# EAGLE design MotorControllerChipTest (EAGLE 9.1.0)
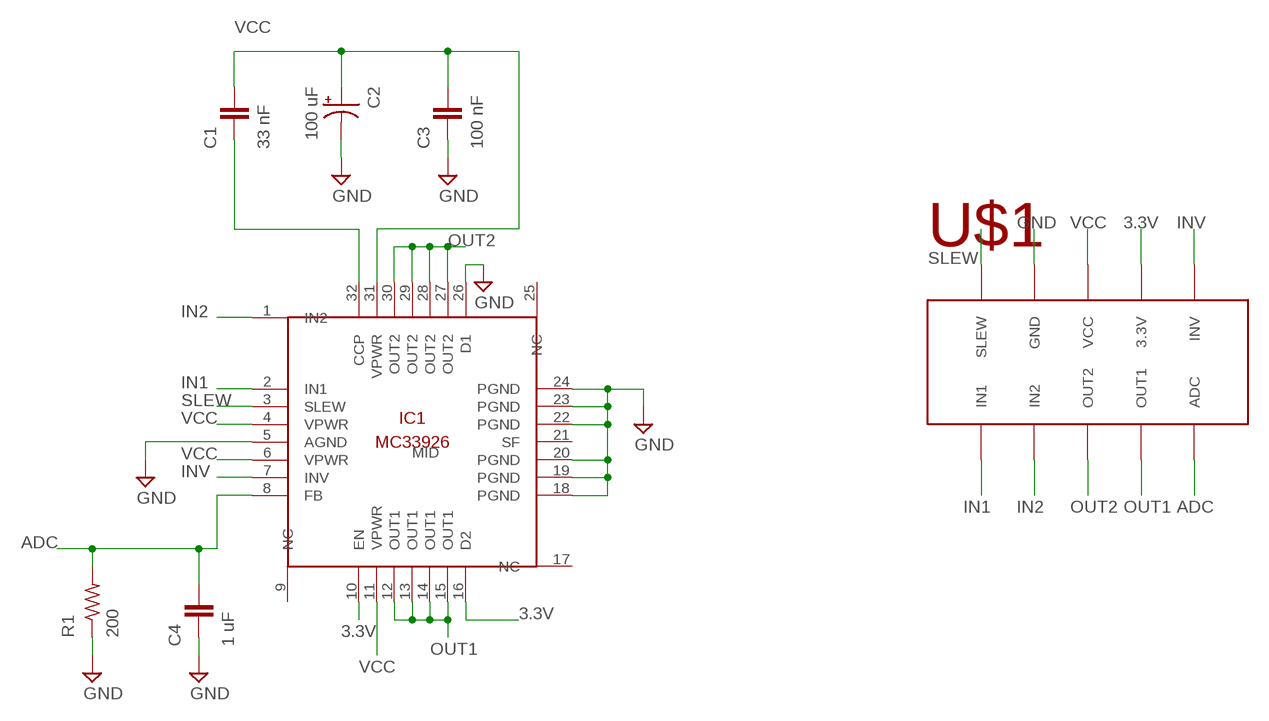
[diagram p0: schematic, sheet 1]

## Parts
C1  33 nF  CAP0603-CAP  [0603-CAP]
C2  100 uF  CAP_POLRADIAL  [.248"CAP_THRU]
C3  100 nF  CAP0603-CAP  [0603-CAP]
C4  1 uF  CAP0603-CAP  [0603-CAP]
IC1  MC33926  [PQFN-32]
R1  200  R-US_R0603  [R0603]
U$1  2X5PIN  [2X5PIN]

## Nets
3.3V: IC1.10(EN) IC1.16(D2) U$1.3.3V
ADC: C4.2 IC1.8(FB) R1.2 U$1.ADC
GND: C2.MINUS(-) C3.1 C4.1 IC1.5(AGND) IC1.18(PGND) IC1.19(PGND) IC1.20(PGND) IC1.22(PGND) IC1.23(PGND) IC1.24(PGND) IC1.26(D1) R1.1 U$1.GND
IN1: IC1.2(IN1) U$1.IN1
IN2: IC1.1(IN2) U$1.IN2
INV: IC1.7(INV) U$1.INV
N$2: C1.1 IC1.32(CCP)
OUT1: IC1.12(OUT1) IC1.13(OUT1) IC1.14(OUT1) IC1.15(OUT1) U$1.OUT1
OUT2: IC1.27(OUT2) IC1.28(OUT2) IC1.29(OUT2) IC1.30(OUT2) U$1.OUT2
SLEW: IC1.3(SLEW) U$1.SLEW
VCC: C1.2 C2.PLUS(+) C3.2 IC1.4(VPWR) IC1.6(VPWR) IC1.11(VPWR) IC1.31(VPWR) U$1.VCC
Unconnected: IC1.9(NC) IC1.17(NC) IC1.21(SF) IC1.25(NC) IC1.MID(AGND)

## Library data of the parts
C1 C3 C4 = pie:CAP: Capacitor Standard 0603 ceramic capacitor, and 0.1" leaded capacitor.; PIE-INT-REF-NUM: CAPACITOR-GENERIC
C2 = pie:CAP_POL: Capacitor Polarized These are standard SMD and PTH capacitors. Normally 10uF, 47uF, and 100uF in electrolytic and tantalum varieties. Always verify the external diameter of the through hole cap, it varies with capacity, voltage, and manufacturer. The EIA devices should be standard.
IC1 = pie:MC33926: https://www.nxp.com/docs/en/data-sheet/MC33926.pdf
R1 = pie:R-US_: RESISTOR, American symbol; DESCRIPTION: RESISTOR, American symbol; DISTRIBUTOR: DigiKey; MANUFACTURER: Rohm Semiconductor; NOTES: Cut Tape; PACKAGE: R0603; VALUE: >VALUE
U$1 = pie:2X5PIN: 10 pin breakout for motor controller chip test board

## Board
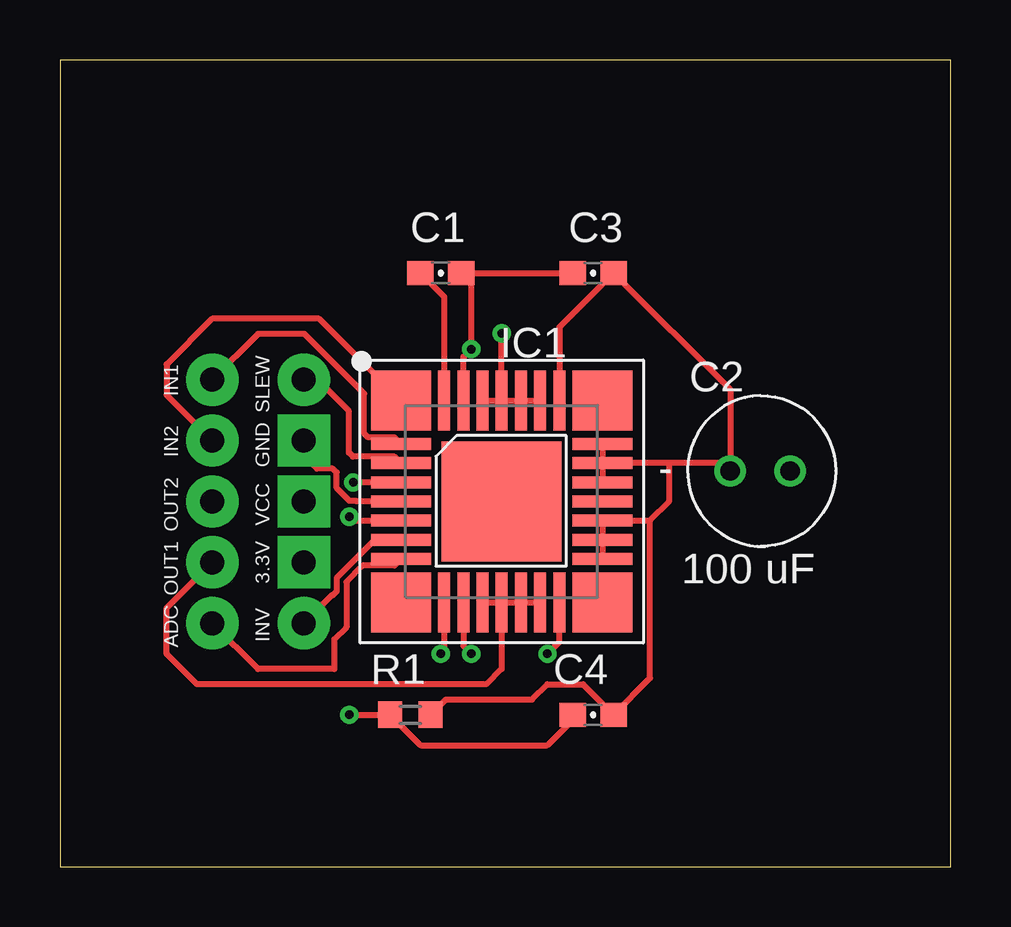
[diagram p1: board, top side]
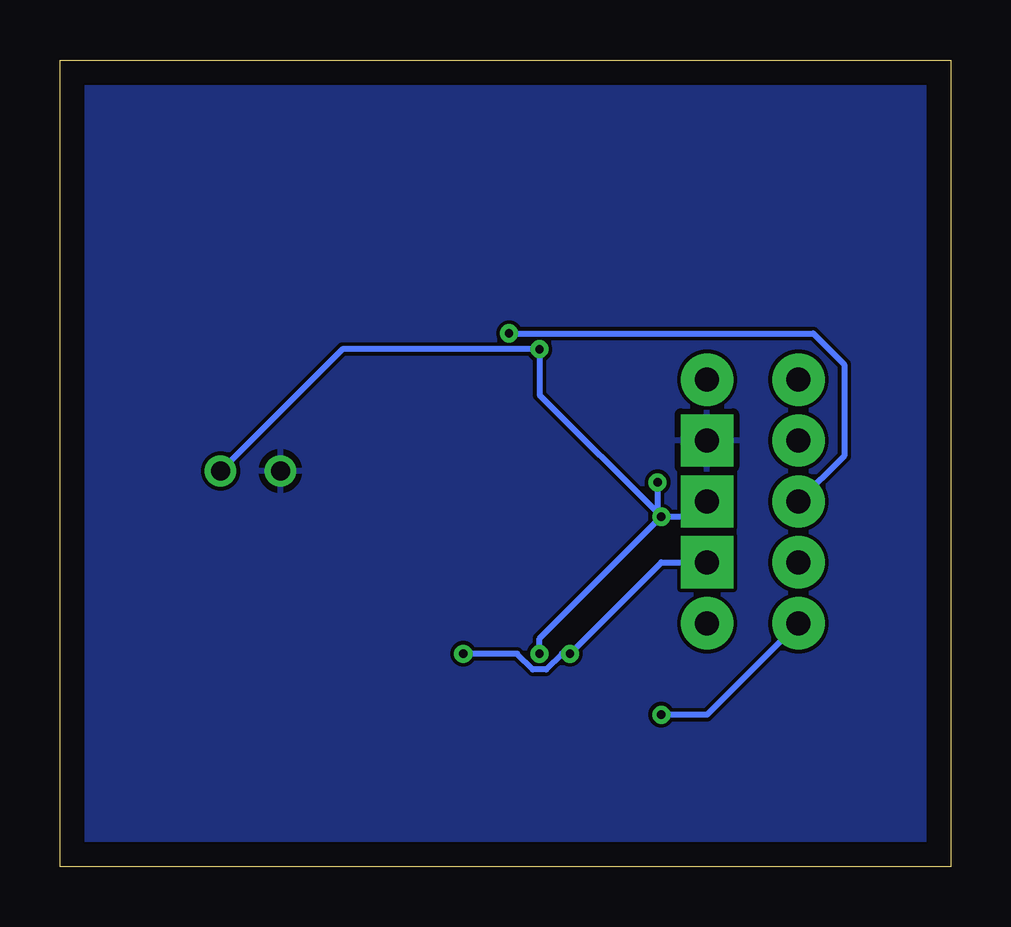
[diagram p2: board, bottom side, seen from below]

Size 37.13 x 33.65 mm. Coordinates in mm from the lower left corner, seen from the top.
Outline: 0,0 37.13,0 37.13,33.65 0,33.65 0,0
Copper layers (1*16): Top 0.035mm / dielectric 1.5mm / Bottom 0.035mm
Design rules "default": minimum track width 6mil, minimum drill 0.35mm, track to track 6mil, track to pad 6mil, pad to pad 6mil, via to via 6mil, smd to smd 6mil, copper to edge 40mil, drill to drill 6mil, minimum pad ring 10mil, minimum via ring 8mil, stop-mask expansion 4mil, vias tented up to drill 0mil, thermal gap 10mil

### Footprints (pad centres in the part's own frame; a part is rotated, then mirrored left to right if it is on the bottom)
0603-CAP = smd 1.1 x 1: 1 -0.85,0; 2 0.85,0
.248"CAP_THRU = drill 0.8: MINUS 0,0; PLUS 2.5,0
PQFN-32 = smd 2.5 x 2.5: 1 -4.2,4.2; 9 -4.2,-4.2; 17 4.2,-4.2; 25 4.2,4.2 | smd 2.5 x 0.5: 2 -4.2,2.4; 3 -4.2,1.6; 4 -4.2,0.8; 5 -4.2,0; 6 -4.2,-0.8; 7 -4.2,-1.6; 8 -4.2,-2.4; 18 4.2,-2.4; 19 4.2,-1.6; 20 4.2,-0.8; 21 4.2,0; 22 4.2,0.8; 23 4.2,1.6; 24 4.2,2.4 | smd 0.5 x 2.5: 10 -2.4,-4.2; 11 -1.6,-4.2; 12 -0.8,-4.2; 13 0,-4.2; 14 0.8,-4.2; 15 1.6,-4.2; 16 2.4,-4.2; 26 2.4,4.2; 27 1.6,4.2; 28 0.8,4.2; 29 0,4.2; 30 -0.8,4.2; 31 -1.6,4.2; 32 -2.4,4.2 | smd 5 x 5: MID 0,0
R0603 = smd 1 x 1.1: 1 -0.85,0; 2 0.85,0
2X5PIN = drill 1 pad 2.184 square: 3.3V 7.62,1.27; GND 2.54,1.27; VCC 5.08,1.27 | drill 1 pad 2.184: ADC 10.16,-2.54; IN1 0,-2.54; IN2 2.54,-2.54; INV 10.16,1.27; OUT1 7.62,-2.54; OUT2 5.08,-2.54; SLEW 0,1.27

### Placement (x,y rotation side)
C1  15.88,24.77 0 top
C2  27.94,16.51 0 top
C3  22.23,24.77 180 top
C4  22.23,6.35 180 top
IC1  18.41,15.24 0 top
R1  14.61,6.35 180 top
U$1  8.89,20.32 270 top

### Tracks (layer width: path | path; a pad name or v marks a point on that pad's centre or on a via)
3.3V  (via drill 0.35)
  Top 0.254: IC1.10 16.02,9.03 v15.88,8.89 | v20.32,8.89 20.82,9.38 IC1.16
  Bottom 0.254: v20.32,8.89 18.07,8.89 17.42,8.23 16.87,8.23 16.21,8.89 v15.88,8.89 12.06,12.7 U$1.3.3V
ADC  (via drill 0.35)
  Top 0.254: IC1.8 13.94,12.57 12.62,12.57 11.94,11.88 11.94,10 11.43,9.49 11.43,8.26 8.26,8.26 U$1.ADC | v12.06,6.35 R1.2 15.03,5.08 20.32,5.08 21.38,6.13 C4.2
  Bottom 0.254: U$1.ADC 10.16,6.35 v12.06,6.35
GND
  Top 0.254: IC1.24 IC1.23 | IC1.23 IC1.22 | IC1.18 IC1.19 IC1.20 24.6,14.44 | 25.4,16.84 27.61,16.84 C2.MINUS 27.94,19.9 C3.1 20.82,22.5 IC1.26 | 25.4,16.84 IC1.23 | IC1.5 12.36,15.24 12.34,15.26 12.06,15.26 11.53,15.8 11.53,16.45 11.37,16.61 10.72,16.61 10.16,17.17 U$1.GND | 24.6,14.44 25.4,15.24 25.4,16.84 | R1.1 16.09,6.99 19.68,6.99 20.32,7.62 21.8,7.62 C4.1 24.6,7.88 24.6,14.44
  pour Bottom: 0,0 0,80.01 37.47,80.01 37.47,0
IN1
  Top 0.254: IC1.2 13.94,17.91 12.85,17.91 12.69,18.07 12.69,19.73 10.2,22.23 8.26,22.23 U$1.IN1
IN2
  Top 0.254: IC1.1 10.79,22.86 6.35,22.86 4.45,20.95 4.45,19.68 U$1.IN2
INV
  Top 0.254: U$1.INV 11.33,11.33 11.37,11.33 11.53,11.49 11.53,12.05 13.12,13.64 IC1.7
N$2
  Top 0.254: C1.1 16.02,23.77 IC1.32
OUT1
  Top 0.254: IC1.12 IC1.13 | IC1.13 IC1.14 IC1.15 | IC1.13 18.41,8.26 17.78,7.62 5.71,7.62 4.45,8.89 4.45,10.79 U$1.OUT1
OUT2  (via drill 0.35)
  Top 0.254: IC1.30 IC1.29 | IC1.29 IC1.28 IC1.27 | IC1.29 v18.41,22.25
  Bottom 0.254: v18.41,22.25 5.74,22.25 4.45,20.95 4.45,17.14 U$1.OUT2
SLEW
  Top 0.254: U$1.SLEW 10.73,20.32 12.05,19 12.05,17.27 12.21,17.11 13.94,17.11 IC1.3
VCC  (via drill 0.35)
  Top 0.254: IC1.11 16.82,9.22 v17.14,8.89 | v12.06,14.61 12.23,14.44 12.7,14.44 IC1.6 | IC1.31 16.82,21.26 v17.14,21.59 17.14,24.13 17.14,24.34 C1.2 C3.2 | IC1.4 v12.22,16.03
  Bottom 0.254: v17.14,8.89 17.14,9.53 v12.06,14.61 | v12.06,14.61 17.14,19.68 v17.14,21.59 25.36,21.59 C2.PLUS | v12.06,14.61 10.79,14.61 U$1.VCC | v12.22,16.03 12.22,14.76 v12.06,14.61